# EAGLE design MorphingVCA (EAGLE 7.2.0)
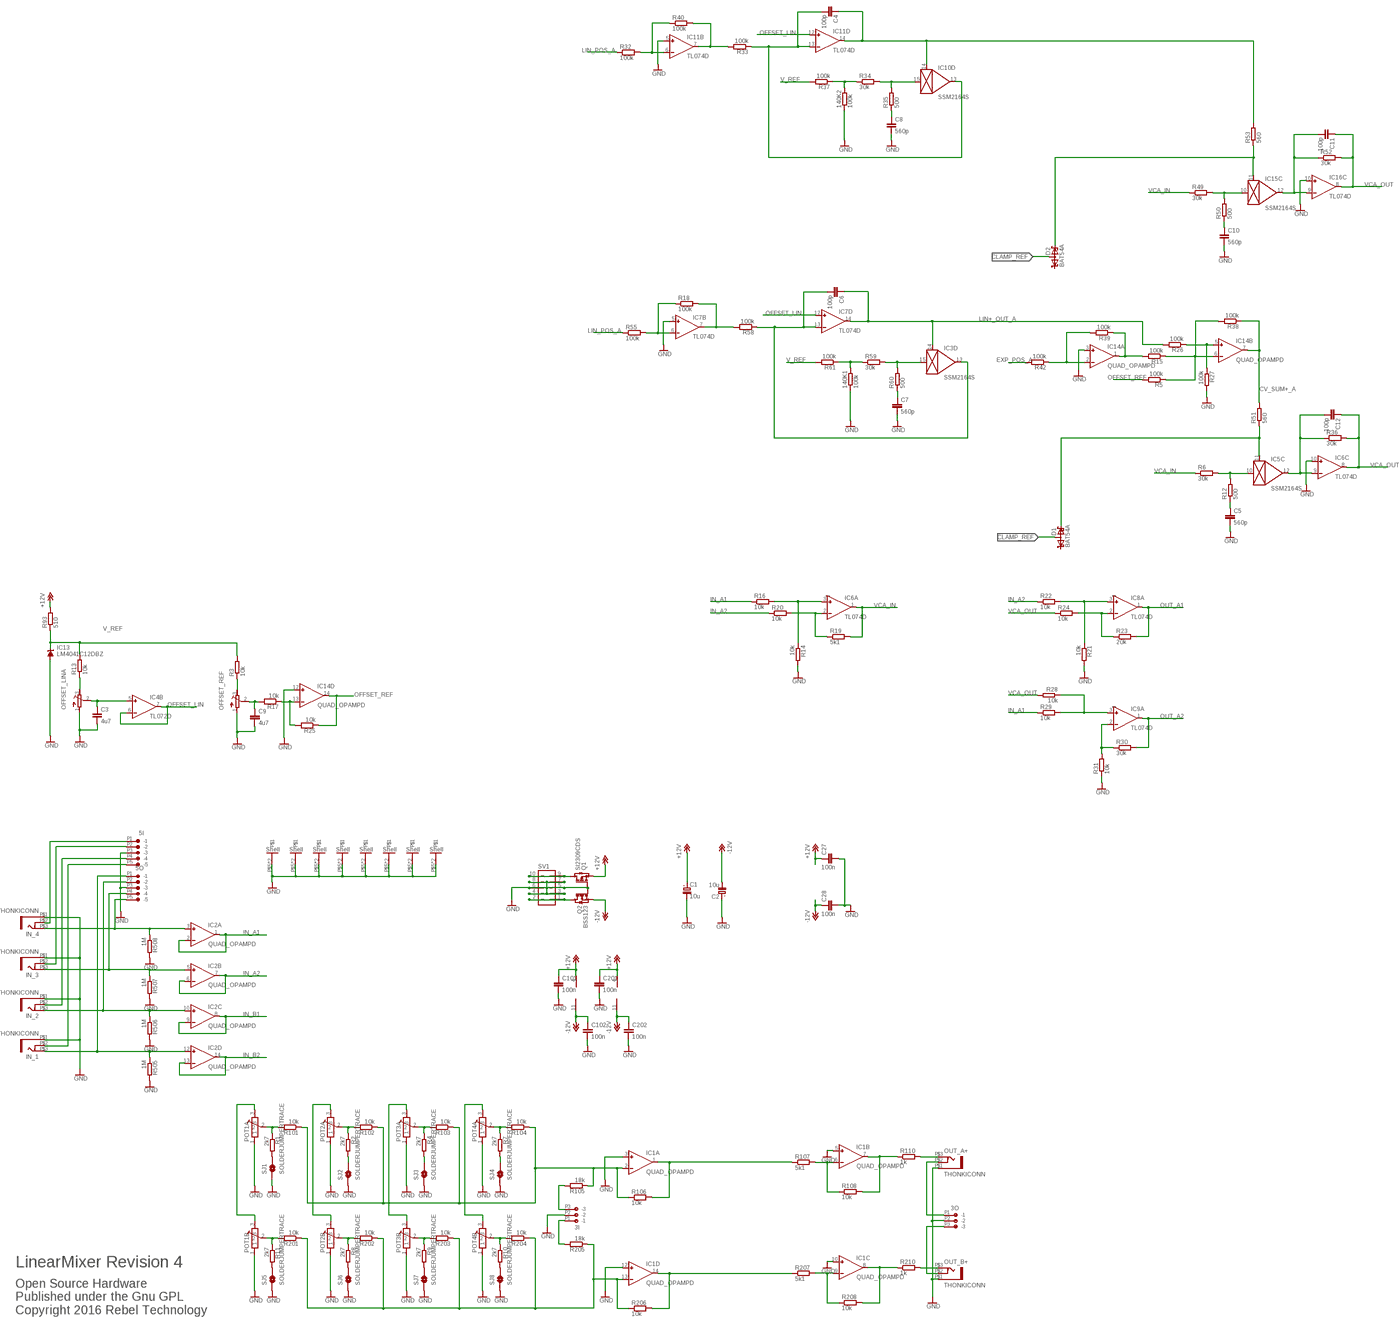
[diagram p0: schematic, sheet 1, overview]
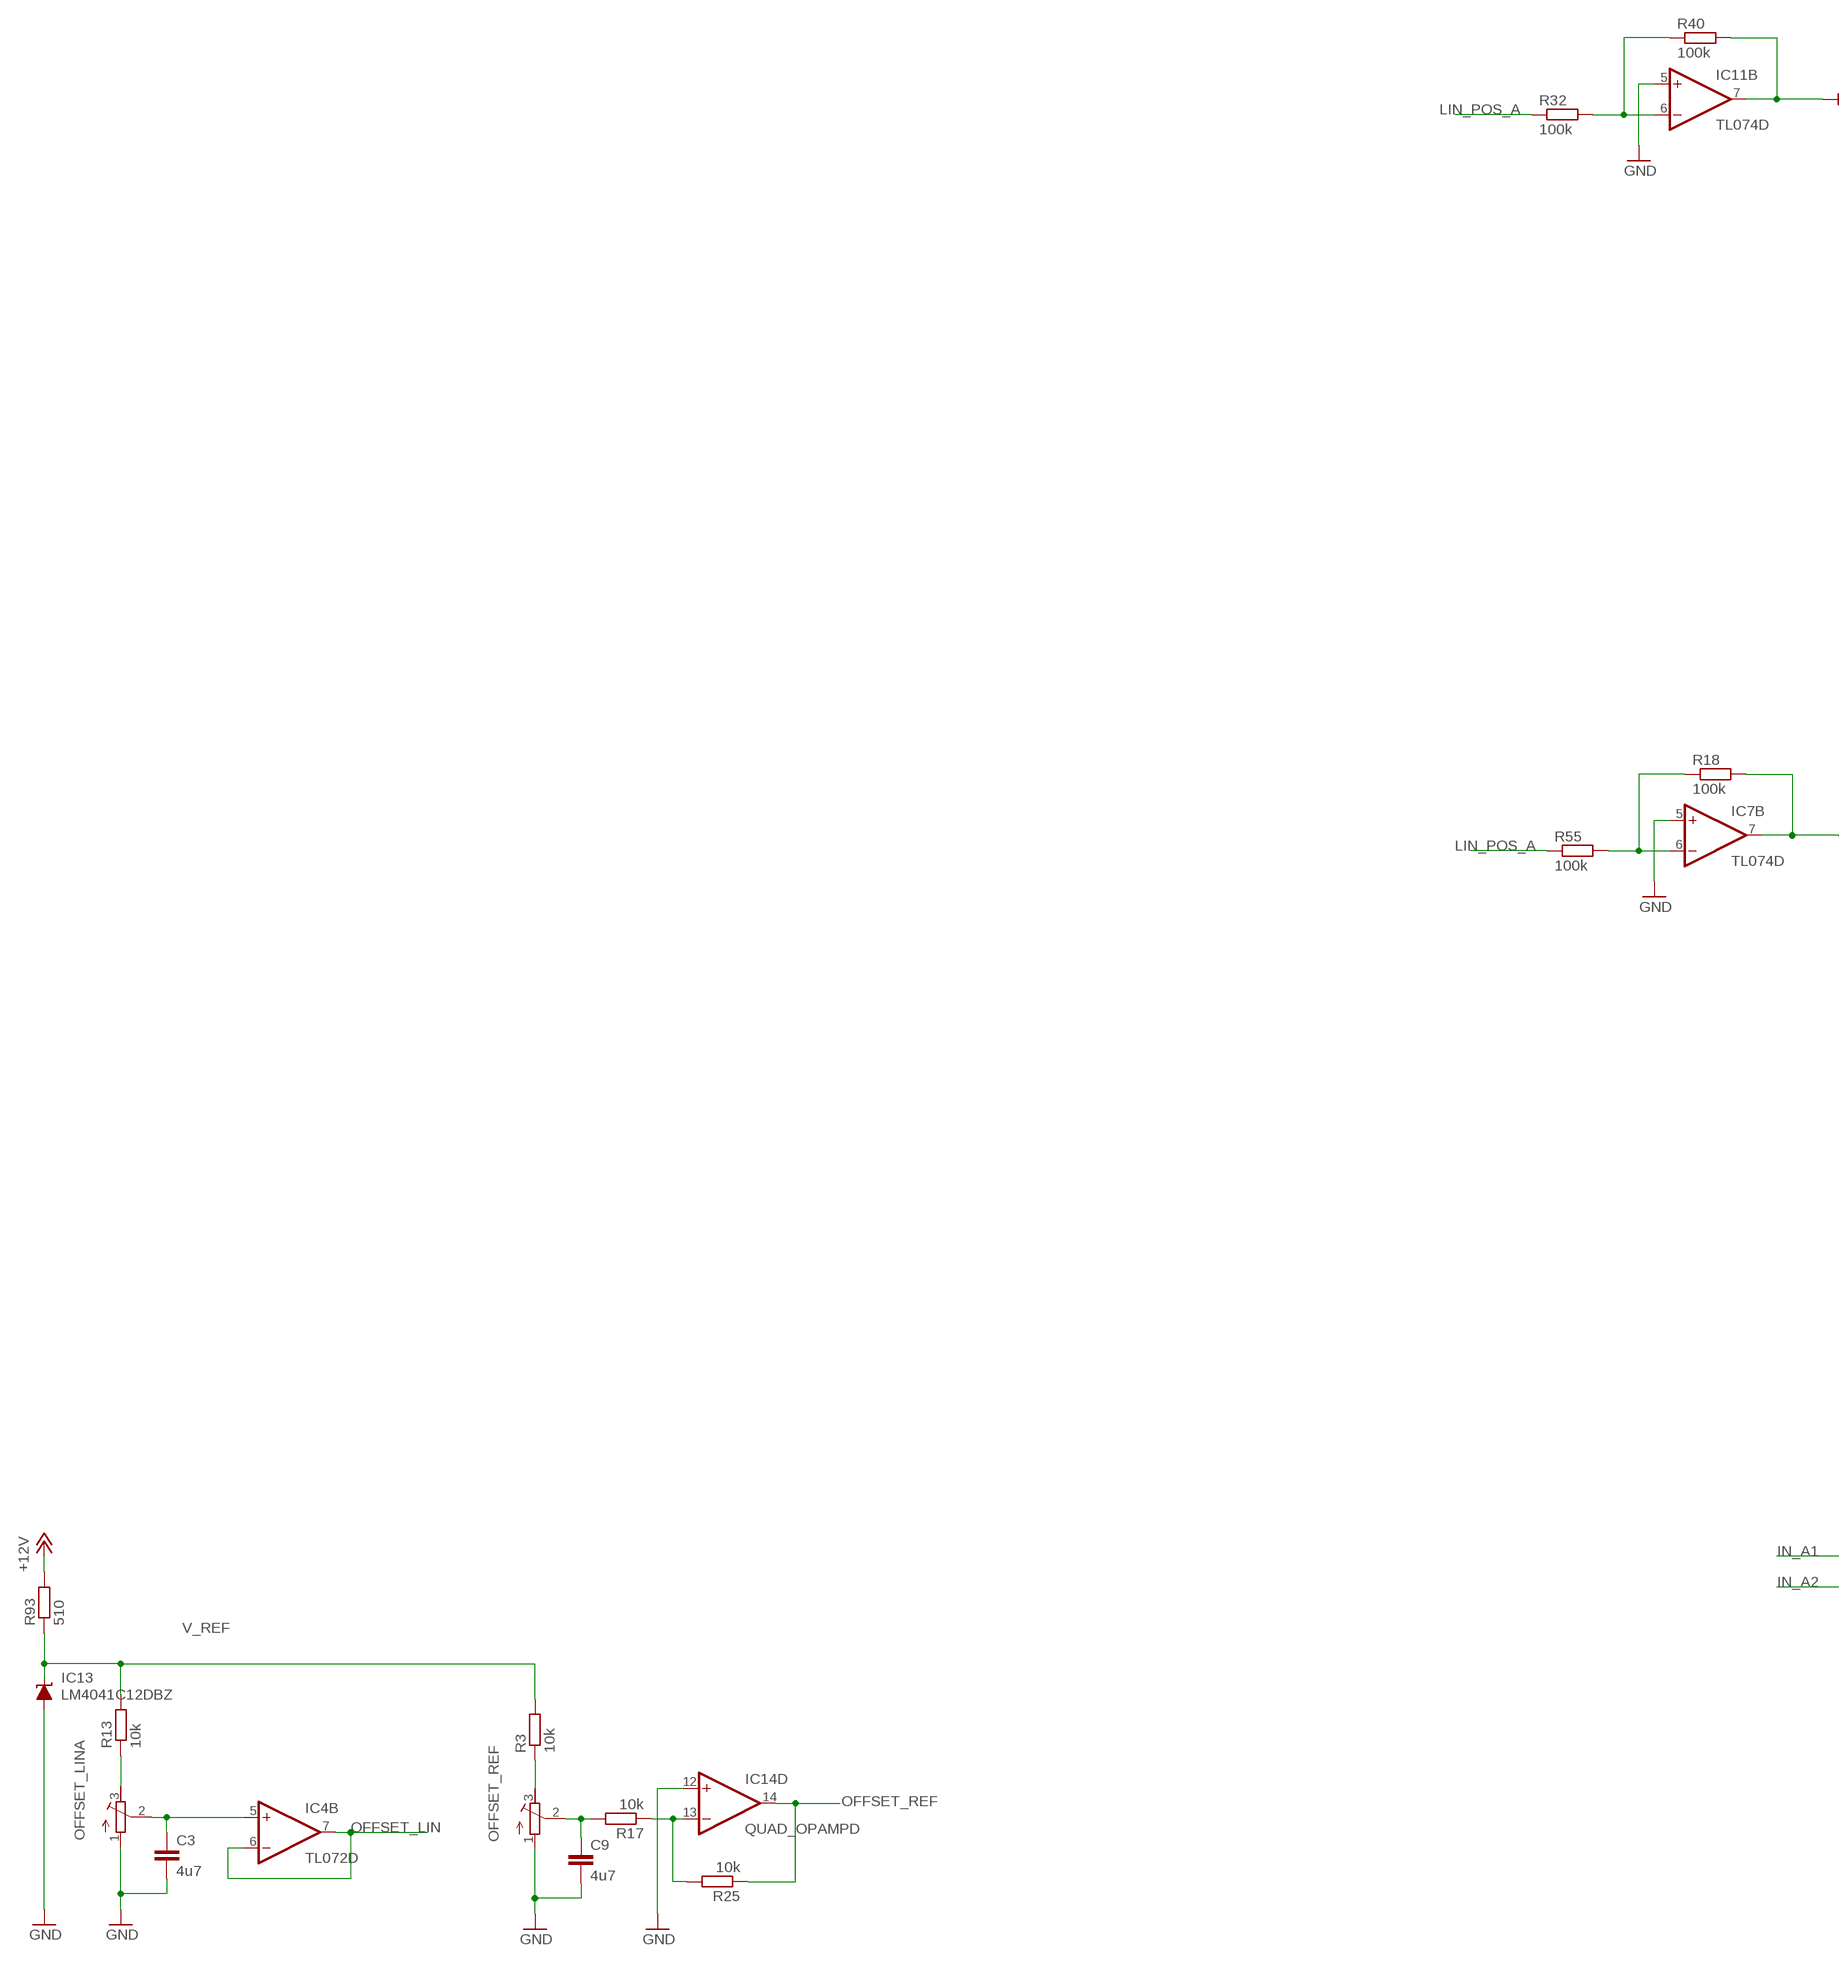
[diagram p1: schematic, sheet 1, part 1 of 4]
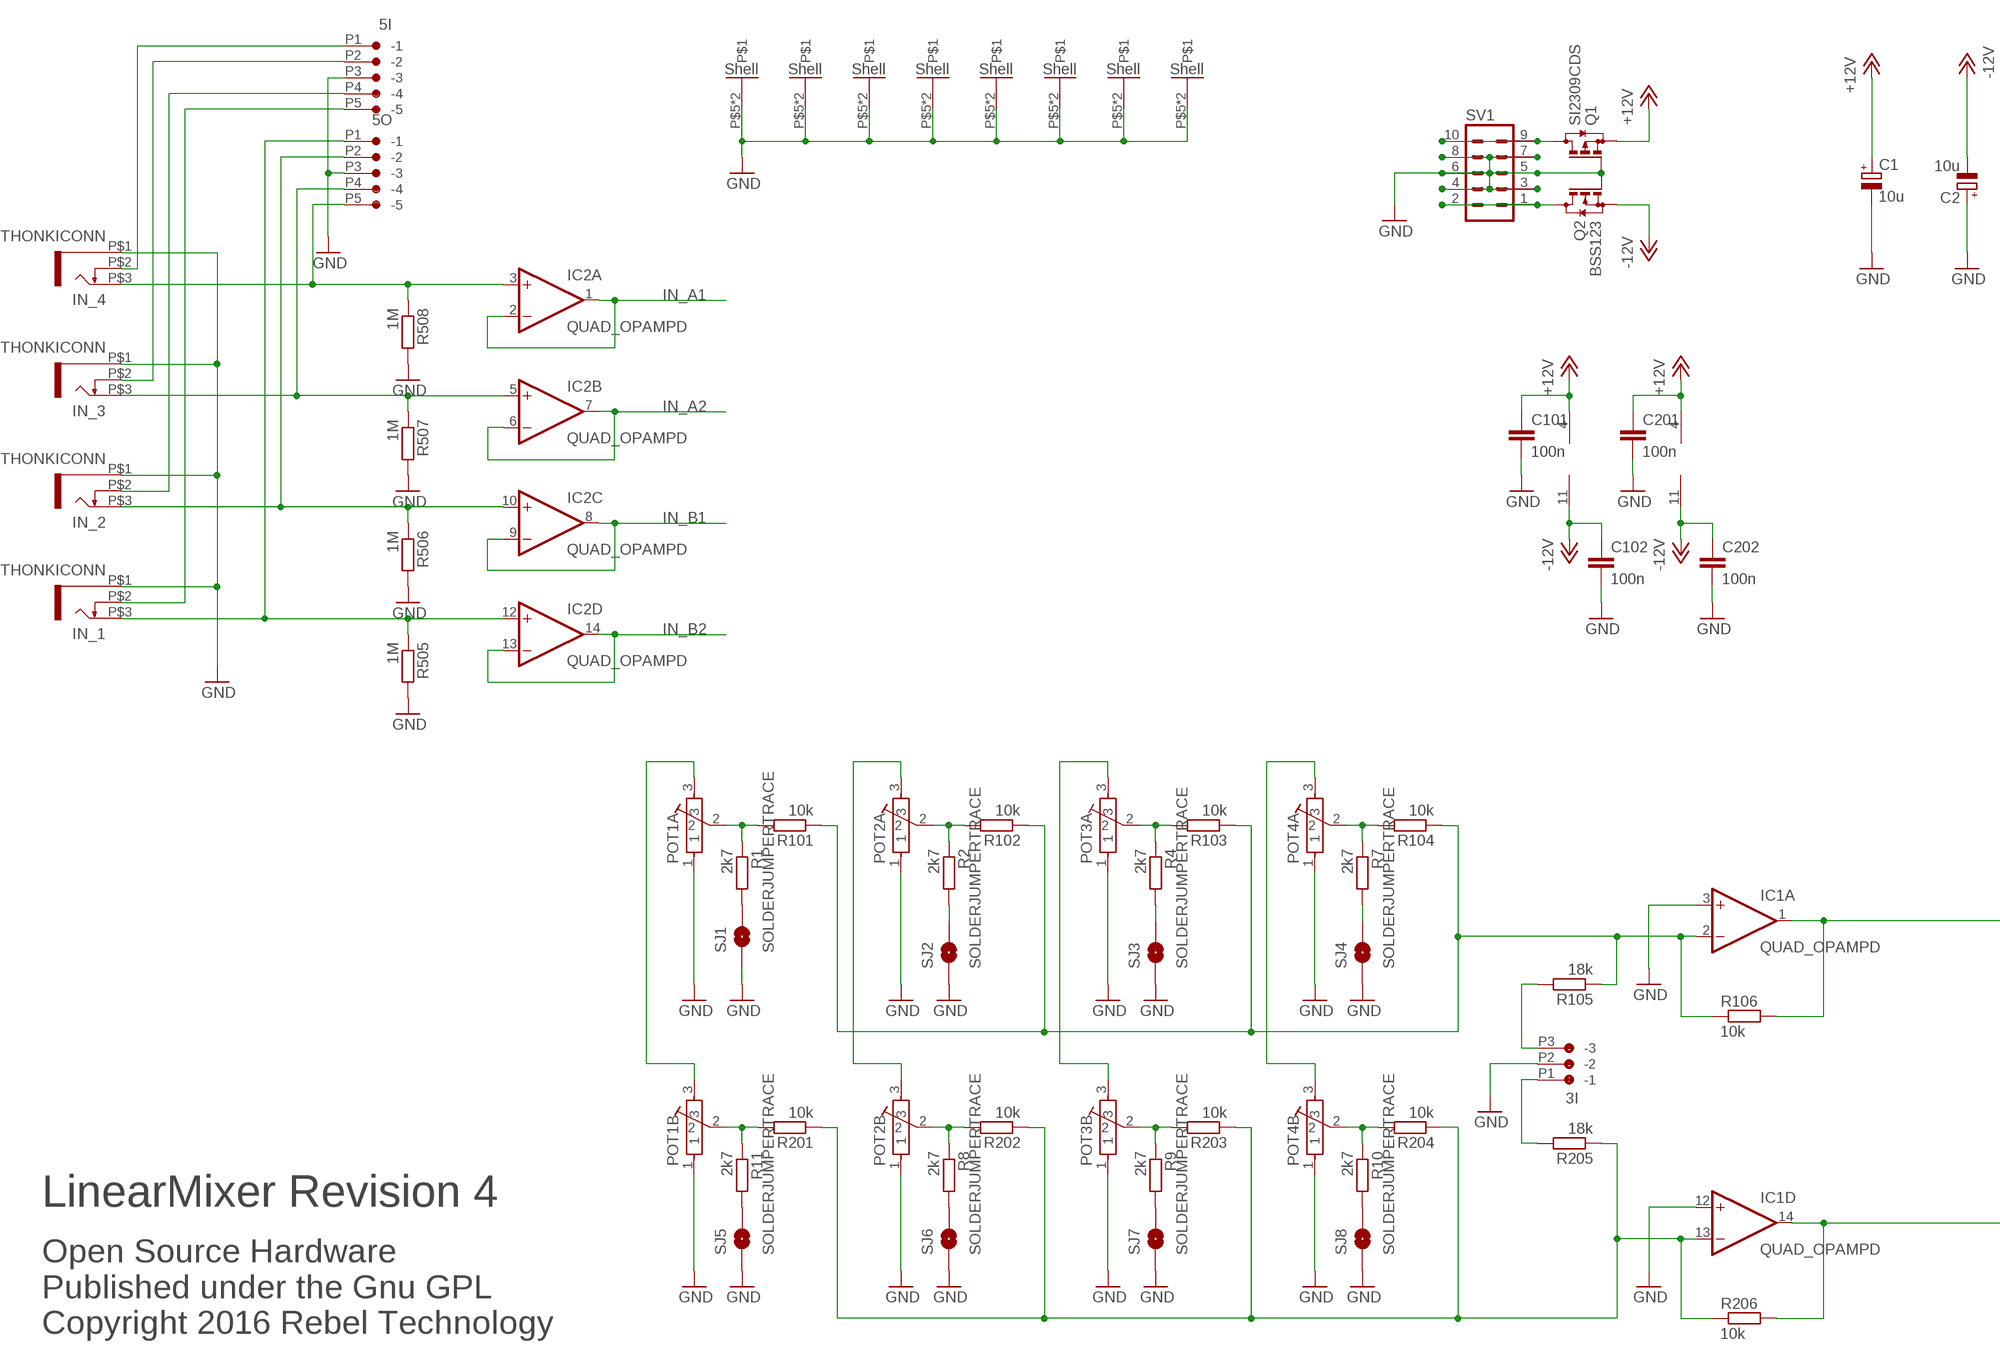
[diagram p2: schematic, sheet 1, part 2 of 4]
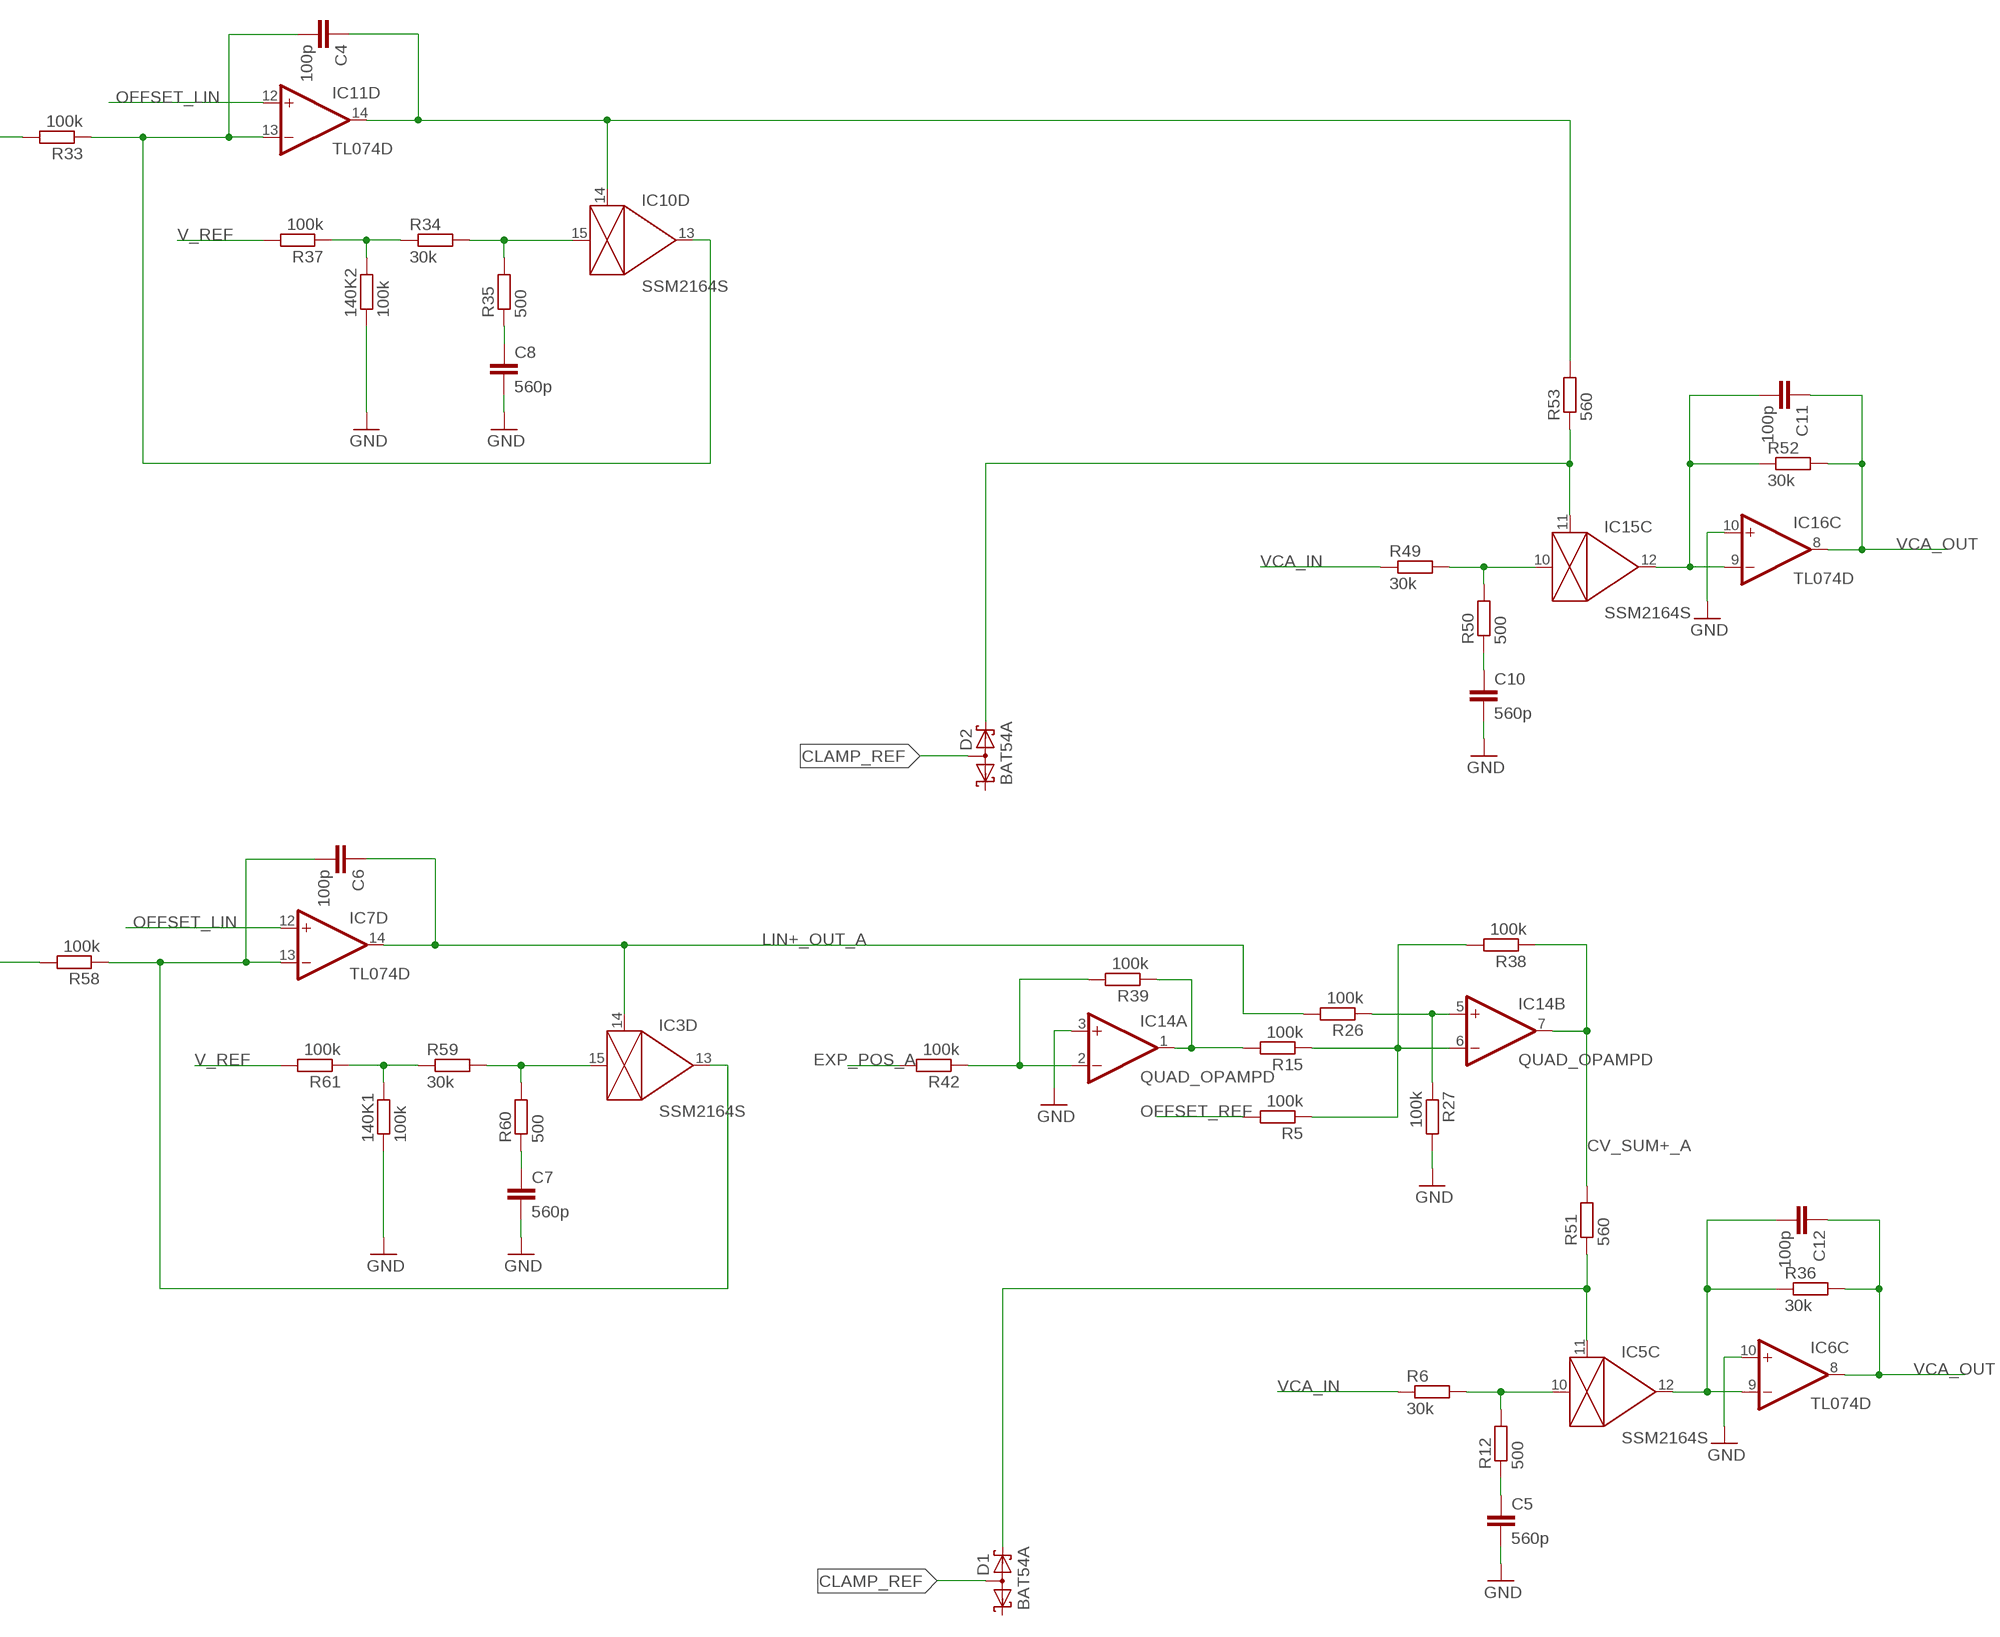
[diagram p3: schematic, sheet 1, part 3 of 4]
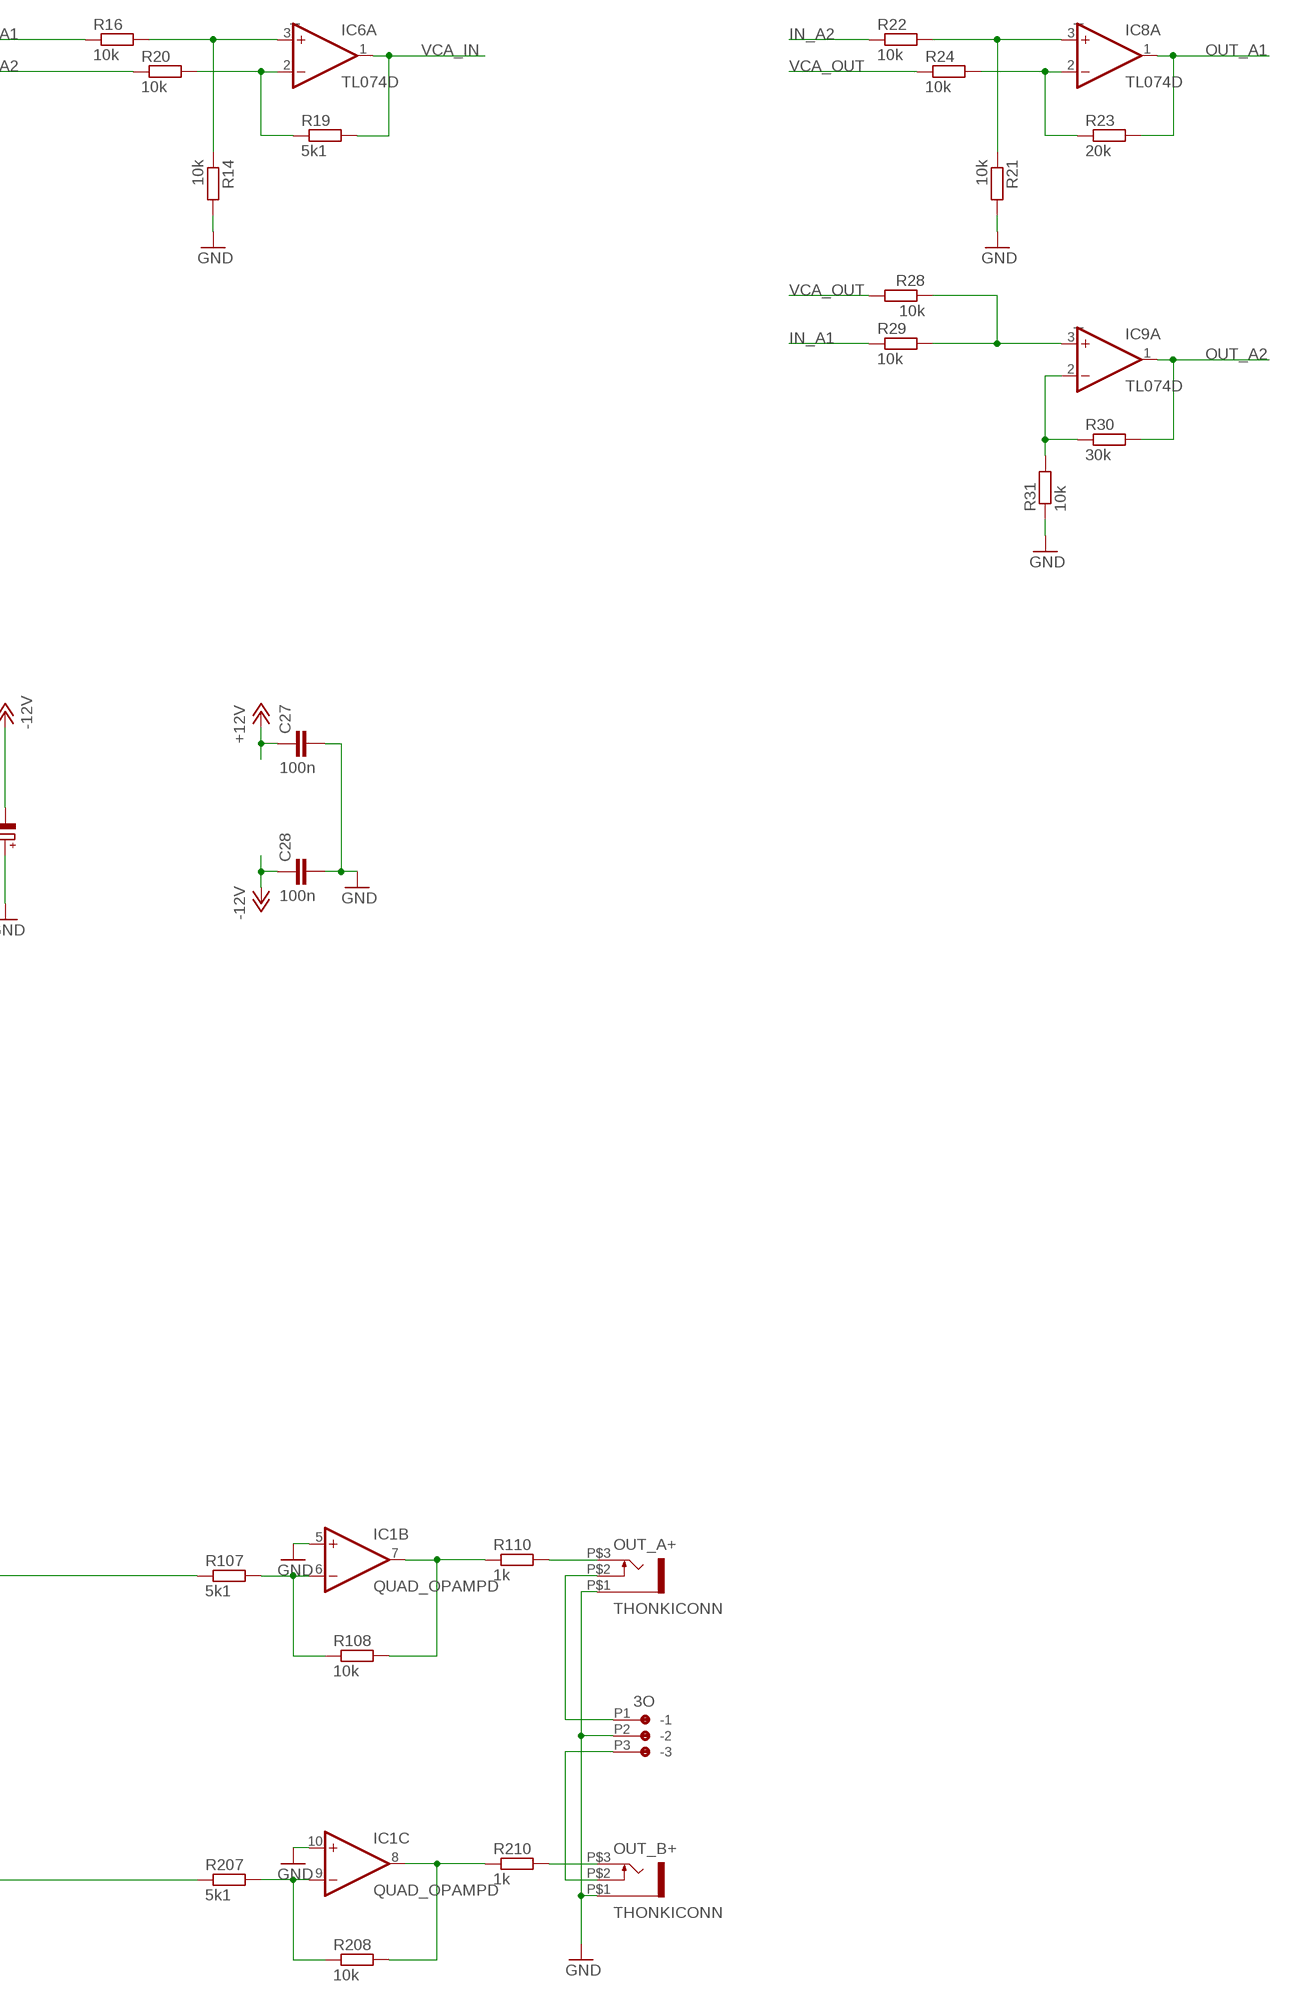
[diagram p4: schematic, sheet 1, part 4 of 4]

## Parts
3I  CON-JST_PH_3W  [CON-JST_PH_3W]
3O  CON-JST_PH_3W  [CON-JST_PH_3W]
5I  CON-JST_PH_5W  [CON-JST_PH_5W]
5O  CON-JST_PH_5W  [CON-JST_PH_5W]
140K1  100k  R-EU_0603  [0603]
140K2  100k  R-EU_0603  [0603]
C1  10u  CPOL-EU153CLV-0505  [153CLV-0505]
C2  10u  CPOL-EU153CLV-0505  [153CLV-0505]
C3  4u7  C-EUC0603K  [C0603K]
C4  100p  C-EUC0603K  [C0603K]
C5  560p  C-EUC0603K  [C0603K]
C6  100p  C-EUC0603K  [C0603K]
C7  560p  C-EUC0603K  [C0603K]
C8  560p  C-EUC0603K  [C0603K]
C9  4u7  C-EUC0603K  [C0603K]
C10  560p  C-EUC0603K  [C0603K]
C11  100p  C-EUC0603K  [C0603K]
C12  100p  C-EUC0603K  [C0603K]
C27  100n  C-EUC0603  [C0603]
C28  100n  C-EUC0603  [C0603]
C101  100n  C-EUC0603  [C0603]
C102  100n  C-EUC0603  [C0603]
C201  100n  C-EUC0603  [C0603]
C202  100n  C-EUC0603  [C0603]
D1  BAT54A  [SOT23]
D2  BAT54A  [SOT23]
IC1  QUAD_OPAMPD  [SO14]
IC2  QUAD_OPAMPD  [SO14]
IC3  SSM2164S  [SOIC16N]
IC4  TL072D  [SO08]
IC5  SSM2164S  [SOIC16N]
IC6  TL074D  [SO14]
IC7  TL074D  [SO14]
IC8  TL074D  [SO14]
IC9  TL074D  [SO14]
IC10  SSM2164S  [SOIC16N]
IC11  TL074D  [SO14]
IC13  LM4041C12DBZ  [DBZ_R-PDSO-G3]
IC14  QUAD_OPAMPD  [SO14]
IC15  SSM2164S  [SOIC16N]
IC16  TL074D  [SO14]
IN_1  THONKICONN  [THONKICONN]
IN_2  THONKICONN  [THONKICONN]
IN_3  THONKICONN  [THONKICONN]
IN_4  THONKICONN  [THONKICONN]
OFFSET_LINA  R-TRIMM64W  [RTRIM64W]
OFFSET_REF  R-TRIMM64W  [RTRIM64W]
OUT_A+  THONKICONN  [THONKICONN]
OUT_B+  THONKICONN  [THONKICONN]
POT1A  POT-ALPS-RK09L1140  [POT-ALPS-RK09L1140]
POT1B  POT-ALPS-RK09L1140  [POT-ALPS-RK09L1140]
POT2A  POT-ALPS-RK09L1140  [POT-ALPS-RK09L1140]
POT2B  POT-ALPS-RK09L1140  [POT-ALPS-RK09L1140]
POT3A  POT-ALPS-RK09L1140  [POT-ALPS-RK09L1140]
POT3B  POT-ALPS-RK09L1140  [POT-ALPS-RK09L1140]
POT4A  POT-ALPS-RK09L1140  [POT-ALPS-RK09L1140]
POT4B  POT-ALPS-RK09L1140  [POT-ALPS-RK09L1140]
Q1  SI2309CDS  BSS84  [SOT23]
Q2  BSS123  [SOT23]
R1  2k7  R-EU_R0603  [R0603]
R2  2k7  R-EU_R0603  [R0603]
R3  10k  R-EU_0603  [0603]
R4  2k7  R-EU_R0603  [R0603]
R5  100k  R-EU_0603  [0603]
R6  30k  R-EU_0603  [0603]
R7  2k7  R-EU_R0603  [R0603]
R8  2k7  R-EU_R0603  [R0603]
R9  2k7  R-EU_R0603  [R0603]
R10  2k7  R-EU_R0603  [R0603]
R11  2k7  R-EU_R0603  [R0603]
R12  500  R-EU_0603  [0603]
R13  10k  R-EU_0603  [0603]
R14  10k  R-EU_0603  [0603]
R15  100k  R-EU_0603  [0603]
R16  10k  R-EU_0603  [0603]
R17  10k  R-EU_0603  [0603]
R18  100k  R-EU_0603  [0603]
R19  5k1  R-EU_0603  [0603]
R20  10k  R-EU_0603  [0603]
R21  10k  R-EU_0603  [0603]
R22  10k  R-EU_0603  [0603]
R23  20k  R-EU_0603  [0603]
R24  10k  R-EU_0603  [0603]
R25  10k  R-EU_0603  [0603]
R26  100k  R-EU_0603  [0603]
R27  100k  R-EU_0603  [0603]
R28  10k  R-EU_0603  [0603]
R29  10k  R-EU_0603  [0603]
R30  30k  R-EU_0603  [0603]
R31  10k  R-EU_0603  [0603]
R32  100k  R-EU_0603  [0603]
R33  100k  R-EU_0603  [0603]
R34  30k  R-EU_0603  [0603]
R35  500  R-EU_0603  [0603]
R36  30k  R-EU_0603  [0603]
R37  100k  R-EU_0603  [0603]
R38  100k  R-EU_0603  [0603]
R39  100k  R-EU_0603  [0603]
R40  100k  R-EU_0603  [0603]
R42  100k  R-EU_0603  [0603]
R49  30k  R-EU_0603  [0603]
R50  500  R-EU_0603  [0603]
R51  560  R-EU_0603  [0603]
R52  30k  R-EU_0603  [0603]
R53  560  R-EU_0603  [0603]
R55  100k  R-EU_0603  [0603]
R58  100k  R-EU_0603  [0603]
R59  30k  R-EU_0603  [0603]
R60  500  R-EU_0603  [0603]
R61  100k  R-EU_0603  [0603]
R93  510  R-EU_0603  [0603]
R101  10k  R-EU_R0603  [R0603]
R102  10k  R-EU_R0603  [R0603]
R103  10k  R-EU_R0603  [R0603]
R104  10k  R-EU_R0603  [R0603]
R105  18k  R-EU_R0603  [R0603]
R106  10k  R-EU_R0603  [R0603]
R107  5k1  R-EU_R0603  [R0603]
R108  10k  R-EU_R0603  [R0603]
R110  1k  R-EU_R0603  [R0603]
R201  10k  R-EU_R0603  [R0603]
R202  10k  R-EU_R0603  [R0603]
R203  10k  R-EU_R0603  [R0603]
R204  10k  R-EU_R0603  [R0603]
R205  18k  R-EU_R0603  [R0603]
R206  10k  R-EU_R0603  [R0603]
R207  5k1  R-EU_R0603  [R0603]
R208  10k  R-EU_R0603  [R0603]
R210  1k  R-EU_R0603  [R0603]
R505  1M  R-EU_R0603  [R0603]
R506  1M  R-EU_R0603  [R0603]
R507  1M  R-EU_R0603  [R0603]
R508  1M  R-EU_R0603  [R0603]
SJ1  SOLDERJUMPERTRACE  [SJ_2S-TRACE]
SJ2  SOLDERJUMPERTRACE  [SJ_2S-TRACE]
SJ3  SOLDERJUMPERTRACE  [SJ_2S-TRACE]
SJ4  SOLDERJUMPERTRACE  [SJ_2S-TRACE]
SJ5  SOLDERJUMPERTRACE  [SJ_2S-TRACE]
SJ6  SOLDERJUMPERTRACE  [SJ_2S-TRACE]
SJ7  SOLDERJUMPERTRACE  [SJ_2S-TRACE]
SJ8  SOLDERJUMPERTRACE  [SJ_2S-TRACE]
SV1  MA05-2  [MA05-2]

## Nets
+12V: C1.+ C27.1 C101.1 C201.1 IC1.4(P:V+) IC2.4(P:V+) Q1.2(S) R93.2
-10V1: 140K1.2 R59.1 R61.1
-10V2: 140K2.2 R34.1 R37.1
-12V: C2.- C28.1 C102.1 C202.1 IC1.11(P:V-) IC2.11(P:V-) Q2.2(S)
CLAMP_REF: D1.3(AA) D2.3(AA)
CV_SUM+_A: IC14.7(B:OUT) R38.1 R51.2
EXP_POS_A: R42.2
GND: 3I.P2(-2) 3O.P2(-2) 5I.P3(-3) 5O.P3(-3) 140K1.1 140K2.1 C1.- C2.+ C3.2 C5.2 C7.2 C8.2 C9.2 C10.2 C27.2 C28.2 C101.2 C102.2 C201.2 C202.2 IC1.3(A:+IN) IC1.5(B:+IN) IC1.10(C:+IN) IC1.12(D:+IN) IC6.10(C:+IN) IC7.5(B:+IN) IC11.5(B:+IN) IC13.2(A) IC14.3(A:+IN) IC14.12(D:+IN) IC16.10(C:+IN) IN_1.P$1 IN_2.P$1 IN_3.P$1 IN_4.P$1 OFFSET_LINA.1(A) OFFSET_REF.1(A) OUT_A+.P$1 OUT_B+.P$1 POT1A.1 POT1A.P$5 POT1A.P$6 POT1B.1 POT1B.P$5 POT1B.P$6 POT2A.1 POT2A.P$5 POT2A.P$6 POT2B.1 POT2B.P$5 POT2B.P$6 POT3A.1 POT3A.P$5 POT3A.P$6 POT3B.1 POT3B.P$5 POT3B.P$6 POT4A.1 POT4A.P$5 POT4A.P$6 POT4B.1 POT4B.P$5 POT4B.P$6 Q1.1(G) Q2.1(G) R14.2 R21.2 R27.2 R31.1 R505.2 R506.2 R507.2 R508.2 SJ1.1 SJ2.1 SJ3.1 SJ4.1 SJ5.1 SJ6.1 SJ7.1 SJ8.1 SV1.3 SV1.4 SV1.5 SV1.6 SV1.7 SV1.8
IC2_1: C4.2 IC10.13(D:OUT) IC11.13(D:-IN) R33.1
IC2_8: IC14.6(B:-IN) R5.1 R15.1 R38.2
IC2_13: C6.2 IC3.13(D:OUT) IC7.13(D:-IN) R58.1
IC2C_1: D2.2(K2) IC15.11(C:CTRL) R53.1
IC2C_11: D1.2(K2) IC5.11(C:CTRL) R51.1
IN_1: 5O.P1(-1) IC2.12(D:+IN) IN_1.P$3 R505.1
IN_2: 5O.P2(-2) IC2.10(C:+IN) IN_2.P$3 R506.1
IN_3: 5O.P4(-4) IC2.5(B:+IN) IN_3.P$3 R507.1
IN_4: 5O.P5(-5) IC2.3(A:+IN) IN_4.P$3 R508.1
IN_A: 3I.P3(-3) R105.2
IN_A1: IC2.1(A:OUT) IC2.2(A:-IN) R16.1
IN_A2: IC2.6(B:-IN) IC2.7(B:OUT) R20.1 R22.1
IN_B: 3I.P1(-1) R205.2
IN_B1: IC2.8(C:OUT) IC2.9(C:-IN)
IN_B2: IC2.13(D:-IN) IC2.14(D:OUT)
IN_SW_1: 5I.P5(-5) IN_1.P$2
IN_SW_2: 5I.P4(-4) IN_2.P$2
IN_SW_3: 5I.P2(-2) IN_3.P$2
IN_SW_4: 5I.P1(-1) IN_4.P$2
LIN+_OUT_A: C4.1 C6.1 IC3.14(D:CTRL) IC7.14(D:OUT) IC10.14(D:CTRL) IC11.14(D:OUT) R26.2 R53.2
LIN_POS_A: R32.1 R55.1
N$1: Q2.3(D) SV1.1 SV1.2
N$2: IC7.7(B:OUT) R18.2 R58.2
N$3: IC7.6(B:-IN) R18.1 R55.2
N$4: OFFSET_LINA.3(E) R13.1
N$5: IC1.8(C:OUT) R208.2 R210.1
N$6: IC1.7(B:OUT) R108.2 R110.1
N$7: IC1.13(D:-IN) R201.1 R202.1 R203.1 R204.1 R205.1 R206.1
N$8: C3.1 IC4.5(B:+IN) OFFSET_LINA.2(S)
N$9: OUT_A+.P$3 R110.2
N$10: IC1.14(D:OUT) R206.2 R207.1
N$11: IC1.2(A:-IN) R101.1 R102.1 R103.1 R104.1 R105.1 R106.1
N$12: IC14.2(A:-IN) R39.2 R42.1
N$13: IC1.1(A:OUT) R106.2 R107.1
N$14: Q1.3(D) SV1.9 SV1.10
N$15: OUT_B+.P$3 R210.2
N$16: IC14.1(A:OUT) R15.2 R39.1
N$17: R1.2 SJ1.2
N$18: IC1.6(B:-IN) R107.2 R108.1
N$19: OFFSET_REF.3(E) R3.1
N$20: POT1B.2 R11.1 R201.2
N$21: IC14.13(D:-IN) R17.1 R25.2
N$22: R2.2 SJ2.2
N$23: IC1.9(C:-IN) R207.2 R208.1
N$24: R4.2 SJ3.2
N$25: R7.2 SJ4.2
N$26: R11.2 SJ5.2
N$27: IC8.2(A:-IN) R23.1 R24.2
N$28: R8.2 SJ6.2
N$29: POT1A.2 R1.1 R101.2
N$30: POT2B.2 R8.1 R202.2
N$31: POT3B.2 R9.1 R203.2
N$32: R9.2 SJ7.2
N$33: R10.2 SJ8.2
N$34: POT1A.3 POT1B.3
N$35: IC8.3(A:+IN) R21.1 R22.2
N$36: POT2A.3 POT2B.3
N$37: POT3A.3 POT3B.3
N$38: POT4A.3 POT4B.3
N$39: IC14.5(B:+IN) R26.1 R27.1
N$40: C9.1 OFFSET_REF.2(S) R17.2
N$41: C5.1 R12.1
N$42: IC5.10(C:IN) R6.2 R12.2
N$43: C12.2 IC5.12(C:OUT) IC6.9(C:-IN) R36.1
N$44: POT4B.2 R10.1 R204.2
N$45: IC9.2(A:-IN) R30.1 R31.2
N$46: IC6.2(A:-IN) R19.1 R20.2
N$47: POT4A.2 R7.1 R104.2
N$48: IC6.3(A:+IN) R14.1 R16.2
N$49: POT3A.2 R4.1 R103.2
N$50: IC11.7(B:OUT) R33.2 R40.2
N$51: POT2A.2 R2.1 R102.2
N$52: R29.1
N$53: IC9.3(A:+IN) R28.1 R29.2
N$54: C7.1 R60.1
N$55: IC3.15(D:IN) R59.2 R60.2
N$56: C8.1 R35.1
N$57: IC10.15(D:IN) R34.2 R35.2
N$58: IC11.6(B:-IN) R32.2 R40.1
N$62: C10.1 R50.1
N$63: IC15.10(C:IN) R49.2 R50.2
N$64: C11.2 IC15.12(C:OUT) IC16.9(C:-IN) R52.1
OFFSET_LIN: IC4.6(B:-IN) IC4.7(B:OUT) IC7.12(D:+IN) IC11.12(D:+IN)
OFFSET_REF: IC14.14(D:OUT) R5.2 R25.1
OUT_A1: IC8.1(A:OUT) R23.2
OUT_A2: IC9.1(A:OUT) R30.2
OUT_SW_A: 3O.P1(-1) OUT_A+.P$2
OUT_SW_B: 3O.P3(-3) OUT_B+.P$2
V_REF: IC13.1(C) R3.2 R13.2 R37.2 R61.2 R93.1
VCA_IN: IC6.1(A:OUT) R6.1 R19.2 R49.1
VCA_OUT: C11.1 C12.1 IC6.8(C:OUT) IC16.8(C:OUT) R24.1 R28.2 R36.2 R52.2
Unconnected: D1.1(K1) D2.1(K1) IC3.1(E:MODE) IC3.2(A:IN) IC3.3(A:CTRL) IC3.4(A:OUT) IC3.5(B:OUT) IC3.6(B:CTRL) IC3.7(B:IN) IC3.10(C:IN) IC3.11(C:CTRL) IC3.12(C:OUT) IC4.1(A:OUT) IC4.2(A:-IN) IC4.3(A:+IN) IC5.1(E:MODE) IC5.2(A:IN) IC5.3(A:CTRL) IC5.4(A:OUT) IC5.5(B:OUT) IC5.6(B:CTRL) IC5.7(B:IN) IC5.13(D:OUT) IC5.14(D:CTRL) IC5.15(D:IN) IC6.5(B:+IN) IC6.6(B:-IN) IC6.7(B:OUT) IC6.12(D:+IN) IC6.13(D:-IN) IC6.14(D:OUT) IC7.1(A:OUT) IC7.2(A:-IN) IC7.3(A:+IN) IC7.8(C:OUT) IC7.9(C:-IN) IC7.10(C:+IN) IC8.5(B:+IN) IC8.6(B:-IN) IC8.7(B:OUT) IC8.8(C:OUT) IC8.9(C:-IN) IC8.10(C:+IN) IC8.12(D:+IN) IC8.13(D:-IN) IC8.14(D:OUT) IC9.5(B:+IN) IC9.6(B:-IN) IC9.7(B:OUT) IC9.8(C:OUT) IC9.9(C:-IN) IC9.10(C:+IN) IC9.12(D:+IN) IC9.13(D:-IN) IC9.14(D:OUT) IC10.1(E:MODE) IC10.2(A:IN) IC10.3(A:CTRL) IC10.4(A:OUT) IC10.5(B:OUT) IC10.6(B:CTRL) IC10.7(B:IN) IC10.10(C:IN) IC10.11(C:CTRL) IC10.12(C:OUT) IC11.1(A:OUT) IC11.2(A:-IN) IC11.3(A:+IN) IC11.8(C:OUT) IC11.9(C:-IN) IC11.10(C:+IN) IC14.8(C:OUT) IC14.9(C:-IN) IC14.10(C:+IN) IC15.1(E:MODE) IC15.2(A:IN) IC15.3(A:CTRL) IC15.4(A:OUT) IC15.5(B:OUT) IC15.6(B:CTRL) IC15.7(B:IN) IC15.13(D:OUT) IC15.14(D:CTRL) IC15.15(D:IN) IC16.1(A:OUT) IC16.2(A:-IN) IC16.3(A:+IN) IC16.5(B:+IN) IC16.6(B:-IN) IC16.7(B:OUT) IC16.12(D:+IN) IC16.13(D:-IN) IC16.14(D:OUT)

## Notes on the sheet
- LinearMixer Revision 4
- Open Source Hardware
  Published under the Gnu GPL
  Copyright 2016 Rebel Technology

## Power pins joined to a net without a drawn wire
GND: IC3.8(E:GND) IC5.8(E:GND) IC10.8(E:GND) IC15.8(E:GND)
V+: IC3.16(E:V+) IC4.8(P:V+) IC5.16(E:V+) IC6.4(P:V+) IC7.4(P:V+) IC8.4(P:V+) IC9.4(P:V+) IC10.16(E:V+) IC11.4(P:V+) IC14.4(P:V+) IC15.16(E:V+) IC16.4(P:V+)
V-: IC3.9(E:V-) IC4.4(P:V-) IC5.9(E:V-) IC6.11(P:V-) IC7.11(P:V-) IC8.11(P:V-) IC9.11(P:V-) IC10.9(E:V-) IC11.11(P:V-) IC14.11(P:V-) IC15.9(E:V-) IC16.11(P:V-)

## Library data of the parts
3I 3O = Rebel:CON-JST_PH_3W
5I 5O = Rebel:CON-JST_PH_5W
140K1 140K2 R3 R6 R12-R14 R16-R25 R28-R37 R40 R49-R53 R55 R58-R61 R93 = Rebel:R-EU_: RESISTOR, European symbol; OC_FARNELL: unknown
C1 C2 = rcl:CPOL-EU: POLARIZED CAPACITOR, European symbol
C3-C12 = resistor:C-EU: CAPACITOR, European symbol; OC_FARNELL: unknown
C27 C28 = Rebel:C-EU: CAPACITOR, European symbol
C101 C102 C201 C202 = resistor:C-EU: CAPACITOR, European symbol
D1 D2 = diode:BAT54A: Schottky Diodes Source: Fairchild .. BAT54.pdf
IC1 IC2 IC14 = adafruit:QUAD_OPAMP: OP AMP Standard quad package
IC3 IC5 IC10 IC15 = ssm2164:SSM2164; OC_FARNELL: unknown
IC4 = linear:TL072: OP AMP
IC6-IC9 IC11 IC16 = linear:TL074: OP AMP; OC_FARNELL: unknown
IC13 = texas:LM4041: PRECISION MICROPOWER SHUNT VOLTAGE REFERENCE Source: http://focus.ti.com/lit/ds/slcs146e/slcs146e.pdf; MF: TEXAS INSTRUMENT CONNECTORS; MPN: LM4041C12QDBZT; OC_FARNELL: 1771733; OC_NEWARK: 43K3376
IN_1-IN_4 OUT_A+ OUT_B+ = Rebel:THONKICONN
OFFSET_LINA OFFSET_REF = resistor:R-TRIMM: Trimm resistor; OC_FARNELL: unknown
POT1A POT1B POT2A POT2B POT3A POT3B POT4A POT4B = Rebel:POT-ALPS-RK09L
Q1 = transistor-small-signal:BSS84: P-CHANNEL MOS FET
Q2 = transistor-small-signal:BSS123: N-CHANNEL MOS FET
R1 R2 R4 R7-R11 R101-R108 R110 R201-R208 R210 R505-R508 = resistor:R-EU_: RESISTOR, European symbol
R5 R15 R26 R27 R38 R39 R42 = Rebel:R-EU_: RESISTOR, European symbol
SJ1-SJ8 = SparkFun:SOLDERJUMPER: Solder Jumper Standard SMD solder jumper. Used to automate production. Two varients : Normally Open and Normally Closed are the same, but have different paste layers. NC will have a large amount of paste and should jumper during reflow.
SV1 = con-lstb:MA05-2: PIN HEADER; OC_FARNELL: unknown; OC_NEWARK: unknown

## Board
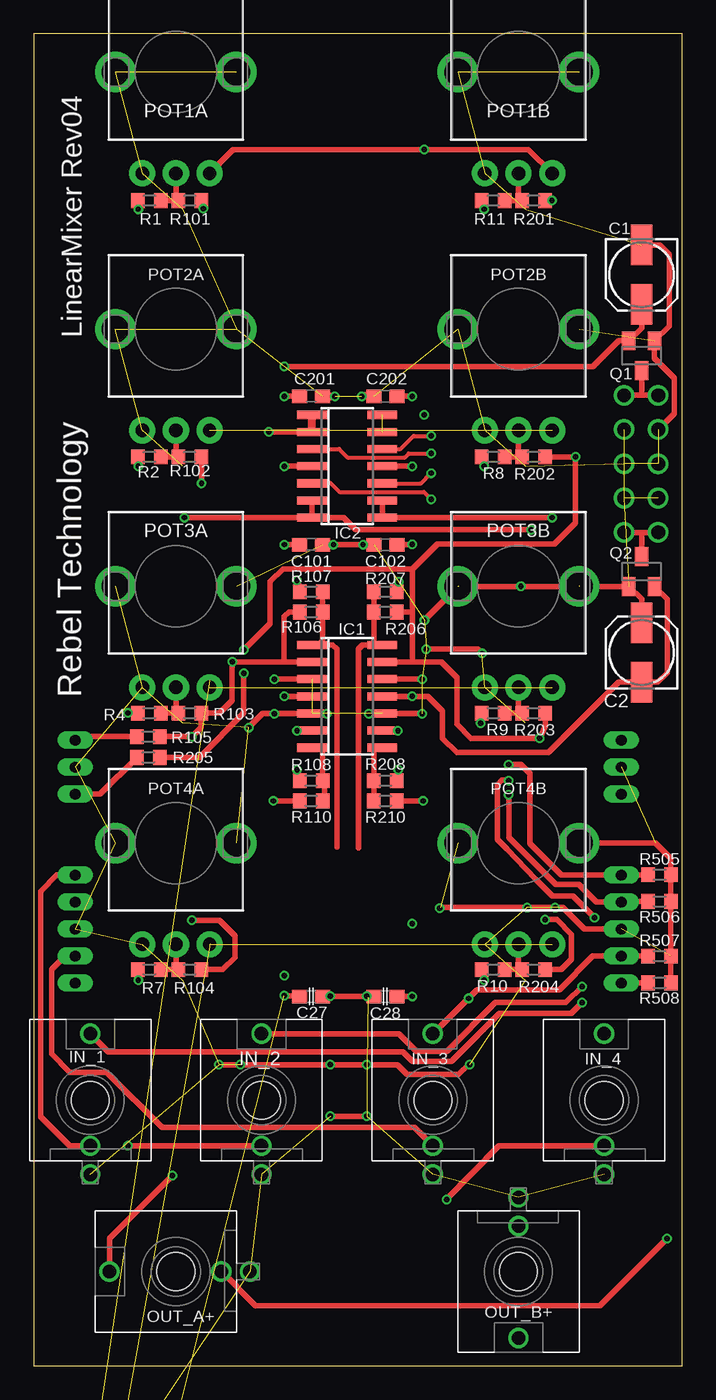
[diagram p5: board, top side]
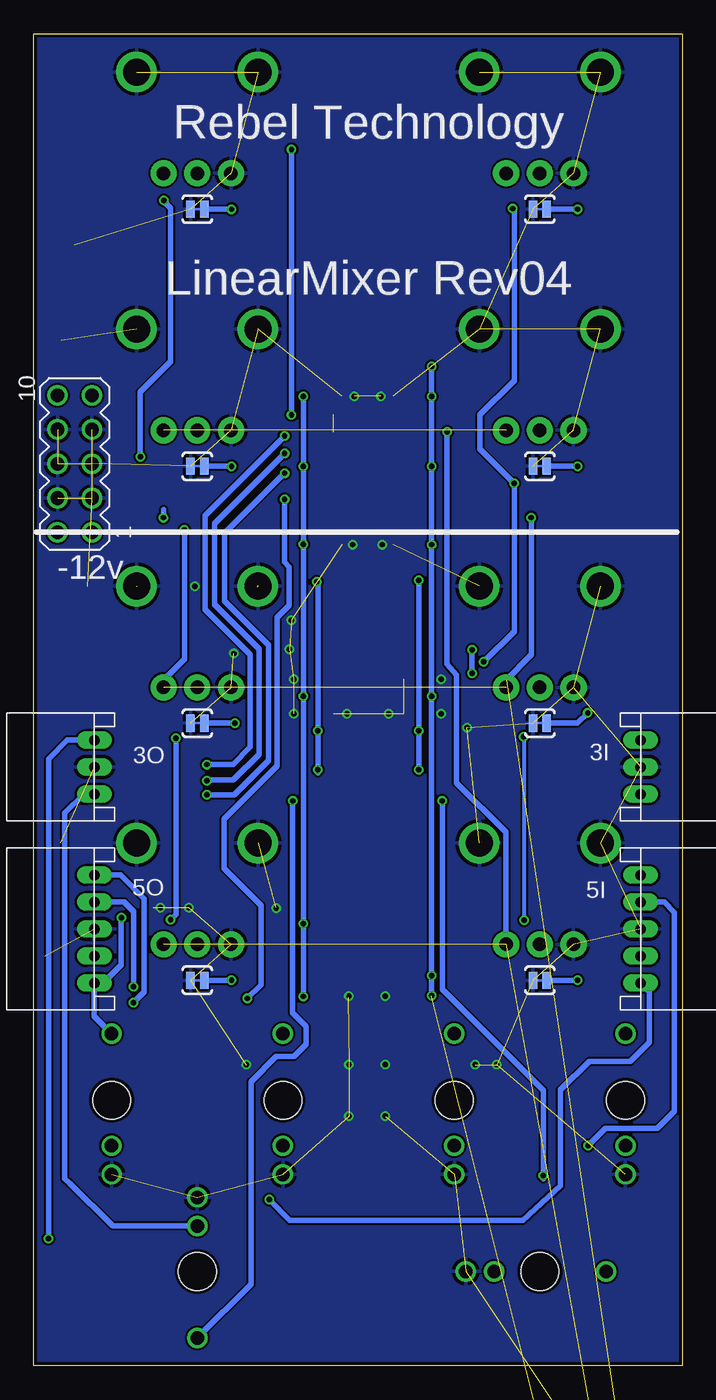
[diagram p6: board, bottom side, seen from below]

Size 48.07 x 98.73 mm. Coordinates in mm from the lower left corner, seen from the top.
Outline: 48.07,0 48.07,98.73 0,98.73 0,0 48.07,0
Copper layers (1*16): Top 0.035mm / dielectric 1.5mm / Bottom 0.035mm
Design rules "SeeedStudio_2layer_DRU_no_angle_20140221": minimum track width 6mil, minimum drill 12mil, track to track 6mil, track to pad 6mil, pad to pad 6mil, via to via 6mil, smd to smd 0mil, copper to edge 10mil, drill to drill 10mil, minimum pad ring 10mil, minimum via ring 6mil, stop-mask expansion 2mil, vias tented up to drill 100mil, thermal gap 10mil

### Footprints (pad centres in the part's own frame; a part is rotated, then mirrored left to right if it is on the bottom)
CON-JST_PH_3W = drill 0.8 long: P1 0,0; P2 -2,0; P3 -4,0
CON-JST_PH_5W = drill 0.8 long: P1 0,0; P2 -2,0; P3 -4,0; P4 -6,0; P5 -8,0
0603 = smd 1.1 x 1: 1 -0.85,0; 2 0.85,0
153CLV-0505 = smd 3 x 1.6: + 2.2,0; - -2.2,0
C0603K = smd 1.05 x 1.08: 1 -0.875,0; 2 0.875,0
C0603 = smd 1.1 x 1: 1 -0.85,0; 2 0.85,0
SOT23 = smd 1 x 1.4: 1 -0.95,-1.1; 2 0.95,-1.1; 3 0,1.1
SO14 = smd 0.6 x 2.2: 1 -3.81,-2.6; 2 -2.54,-2.6; 3 -1.27,-2.6; 4 0,-2.6; 5 1.27,-2.6; 6 2.54,-2.6; 7 3.81,-2.6; 8 3.81,2.6; 9 2.54,2.6; 10 1.27,2.6; 11 0,2.6; 12 -1.27,2.6; 13 -2.54,2.6; 14 -3.81,2.6
SOIC16N = smd 0.6 x 2.2: 1 -4.445,-2.6; 2 -3.175,-2.6; 3 -1.905,-2.6; 4 -0.635,-2.6; 5 0.635,-2.6; 6 1.905,-2.6; 7 3.175,-2.6; 8 4.445,-2.6; 9 4.445,2.6; 10 3.175,2.6; 11 1.905,2.6; 12 0.635,2.6; 13 -0.635,2.6; 14 -1.905,2.6; 15 -3.175,2.6; 16 -4.445,2.6
SO08 = smd 0.6 x 2.2: 1 -1.905,-2.6; 2 -0.635,-2.6; 3 0.635,-2.6; 4 1.905,-2.6; 5 1.905,2.6; 6 0.635,2.6; 7 -0.635,2.6; 8 -1.905,2.6
DBZ_R-PDSO-G3 = smd 0.7 x 1: 1 -0.95,-1.1; 2 0.95,-1.1; 3 0,1.1
THONKICONN = drill 1: P$1 0,-5.5; P$2 0,-3.38; P$3 0,4.92 | hole 2.8: 0,0
RTRIM64W = drill 0.61: 1 1.27,-2.54; 2 1.27,0; 3 1.27,2.54
POT-ALPS-RK09L1140 = drill 1 pad 1.93: 1 -2.5,-7.5; 2 0,-7.5; 3 2.5,-7.5 | drill 2: P$5 -4.5,0; P$6 4.5,0
R0603 = smd 1 x 1.1: 1 -0.85,0; 2 0.85,0
SJ_2S-TRACE = smd 0.635 x 1.27: 1 -0.508,0; 2 0.508,0
MA05-2 = drill 1.016: 1 -5.08,-1.27; 2 -5.08,1.27; 3 -2.54,-1.27; 4 -2.54,1.27; 5 0,-1.27; 6 0,1.27; 7 2.54,-1.27; 8 2.54,1.27; 9 5.08,-1.27; 10 5.08,1.27

### Placement (x,y rotation side)
3I  3.07,42.37 270 bottom
3O  43.57,46.37 90 bottom
5I  3.07,28.36 270 bottom
5O  43.57,36.37 90 bottom
140K1  -5.71,-37.72 0 top  (outside the outline)
140K2  0.13,-172.85 0 top  (outside the outline)
C1  45.07,80.86 270 top
C2  45.07,52.87 90 top
C3  -10.79,-37.72 0 top  (outside the outline)
C4  9.53,-164.97 0 top  (outside the outline)
C5  -2.92,-88.01 0 top  (outside the outline)
C6  4.19,-30.35 0 top  (outside the outline)
C7  9.02,-30.35 0 top  (outside the outline)
C8  14.35,-164.97 0 top  (outside the outline)
C9  -10.79,-60.32 0 top  (outside the outline)
C10  -10.79,-172.59 0 top  (outside the outline)
C11  -5.97,-172.59 0 top  (outside the outline)
C12  1.9,-88.01 0 top  (outside the outline)
C27  20.57,27.36 0 top
C28  26.07,27.36 180 top
C101  20.57,60.87 0 top
C102  26.07,60.87 180 top
C201  20.57,71.86 0 top
C202  26.07,71.86 180 top
D1  -10.03,-89.54 0 top  (outside the outline)
D2  2.41,-166.5 0 top  (outside the outline)
IC1  23.24,49.62 270 top
IC2  23.24,66.67 270 top
IC3  3.43,-22.73 0 top  (outside the outline)
IC4  -8,-24.51 0 top  (outside the outline)
IC5  -5.46,-82.17 0 top  (outside the outline)
IC6  -5.97,-74.55 0 top  (outside the outline)
IC7  1.14,-10.79 0 top  (outside the outline)
IC8  -5.97,-111.89 0 top  (outside the outline)
IC9  -5.97,-127.89 0 top  (outside the outline)
IC10  7.49,-157.35 0 top  (outside the outline)
IC11  6.73,-143.89 0 top  (outside the outline)
IC13  -10.03,-31.88 0 top  (outside the outline)
IC14  -5.97,-54.48 0 top  (outside the outline)
IC15  -5.46,-166.75 0 top  (outside the outline)
IC16  -5.97,-159.13 0 top  (outside the outline)
IN_1  4.19,19.68 0 top
IN_2  16.89,19.68 0 top
IN_3  29.59,19.68 0 top
IN_4  42.29,19.68 0 top
OFFSET_LINA  -8,-13.33 0 top  (outside the outline)
OFFSET_REF  4.7,-50.42 0 top  (outside the outline)
OUT_A+  10.54,6.99 90 top
OUT_B+  35.94,6.99 180 top
POT1A  10.54,95.88 0 top
POT1B  35.94,95.88 0 top
POT2A  10.54,76.83 0 top
POT2B  35.94,76.83 0 top
POT3A  10.54,57.79 0 top
POT3B  35.94,57.79 0 top
POT4A  10.54,38.73 0 top
POT4B  35.94,38.73 0 top
Q1  45.07,74.86 180 top
Q2  45.07,58.87 0 top
R1  8.57,86.36 180 top
R2  8.57,67.36 180 top
R3  -10.79,-67.95 0 top  (outside the outline)
R4  8.57,48.37 180 top
R5  -7.75,-67.95 0 top  (outside the outline)
R6  3.43,-95.38 0 top  (outside the outline)
R7  8.57,29.36 180 top
R8  34.07,67.36 180 top
R9  34.07,48.37 180 top
R10  34.07,29.36 180 top
R11  34.07,86.36 180 top
R12  -10.54,-95.38 0 top  (outside the outline)
R13  -1.14,-37.72 0 top  (outside the outline)
R14  -6.98,-95.38 0 top  (outside the outline)
R15  -6.48,-60.58 0 top  (outside the outline)
R16  -9.53,-98.68 0 top  (outside the outline)
R17  -2.92,-60.58 0 top  (outside the outline)
R18  2.41,-37.72 0 top  (outside the outline)
R19  -9.53,-101.98 0 top  (outside the outline)
R20  -9.53,-105.28 0 top  (outside the outline)
R21  -10.54,-117.98 0 top  (outside the outline)
R22  -6.98,-117.98 0 top  (outside the outline)
R23  -3.43,-117.98 0 top  (outside the outline)
R24  -10.54,-121.29 0 top  (outside the outline)
R25  4.19,-60.58 0 top  (outside the outline)
R26  -10.54,-64.64 0 top  (outside the outline)
R27  -6.98,-64.64 0 top  (outside the outline)
R28  -10.54,-133.98 0 top  (outside the outline)
R29  -6.98,-133.98 0 top  (outside the outline)
R30  -3.43,-133.98 0 top  (outside the outline)
R31  -10.54,-137.29 0 top  (outside the outline)
R32  4.7,-172.85 0 top  (outside the outline)
R33  8.25,-172.85 0 top  (outside the outline)
R34  11.81,-172.85 0 top  (outside the outline)
R35  15.37,-172.85 0 top  (outside the outline)
R36  -3.43,-95.38 0 top  (outside the outline)
R37  -10.54,-176.91 0 top  (outside the outline)
R38  -3.43,-64.64 0 top  (outside the outline)
R39  0.13,-64.64 0 top  (outside the outline)
R40  -6.98,-176.91 0 top  (outside the outline)
R42  3.68,-64.64 0 top  (outside the outline)
R49  -6.98,-180.21 0 top  (outside the outline)
R50  -3.43,-180.21 0 top  (outside the outline)
R51  0.13,-95.38 0 top  (outside the outline)
R52  0.13,-180.21 0 top  (outside the outline)
R53  3.68,-180.21 0 top  (outside the outline)
R55  5.97,-37.72 0 top  (outside the outline)
R58  9.53,-37.72 0 top  (outside the outline)
R59  -10.54,-42.04 0 top  (outside the outline)
R60  -6.98,-42.04 0 top  (outside the outline)
R61  -3.43,-42.04 0 top  (outside the outline)
R93  0.13,-42.04 0 top  (outside the outline)
R101  11.57,86.36 180 top
R102  11.57,67.36 180 top
R103  11.57,48.37 180 top
R104  11.57,29.36 180 top
R105  8.5,46.62 180 top
R106  20.57,55.87 0 top
R107  20.57,57.37 180 top
R108  20.57,43.37 0 top
R110  20.57,41.87 180 top
R201  37.07,86.36 180 top
R202  37.07,67.36 180 top
R203  37.07,48.37 180 top
R204  37.07,29.36 180 top
R205  8.5,45.09 180 top
R206  26.07,55.87 180 top
R207  26.07,57.37 0 top
R208  26.07,43.37 180 top
R210  26.07,41.87 0 top
R505  46.4,36.4 0 top
R506  46.4,34.41 0 top
R507  46.4,30.36 0 top
R508  46.4,28.38 0 top
SJ1  10.54,85.72 0 bottom
SJ2  10.54,66.67 0 bottom
SJ3  10.54,47.62 0 bottom
SJ4  10.54,28.57 0 bottom
SJ5  35.94,85.72 0 bottom
SJ6  35.94,66.67 0 bottom
SJ7  35.94,47.62 0 bottom
SJ8  35.94,28.57 0 bottom
SV1  45.03,66.85 90 bottom

### Tracks (layer width: path | path; a pad name or v marks a point on that pad's centre or on a via)
+12V  (via drill 0.4)  (1 unrouted)
  Top 0.305: 20.07,71.85 C201.1
  Top 0.406: v18.57,49.62 IC1.4 | C101.1 v18.57,60.87 | C201.1 v18.57,71.86 | IC2.4 v18.58,66.67 v18.57,66.66 | C1.+ 45.07,76.91 Q1.2 43.37,75.96 41.47,74.06 v18.57,74.06 | v18.57,27.42 v18.57,27.41 19.67,27.41 C27.1 | 18.61,28.96 v18.57,28.92
  Bottom 0.406: v18.57,74.06 v18.57,71.86 v18.57,66.66 v18.57,60.87 v18.57,49.62 v18.57,28.92 v18.57,27.42
-10V1  (2 unrouted)
-10V2  (2 unrouted)
-12V  (via drill 0.4)
  Top 0.406: IC2.11 v28.07,66.67 | C202.1 v28.07,71.86 | C102.1 v28.06,60.87 v28.07,60.88 | IC1.11 v28.07,49.62 | v28.07,49.62 | Q2.2 46.97,56.82 46.97,51.37 46.27,50.66 C2.- 43.37,50.66 38.16,45.46 31.37,45.46 30.32,46.51 30.32,48.52 29.22,49.62 v28.07,49.62 | v28.07,27.38 C28.1 | v28.07,32.77
  Bottom 0.406: v28.07,71.86 v28.07,66.67 v28.07,60.88 v28.07,49.62 v28.07,32.77 v28.07,27.38
CLAMP_REF  (1 unrouted)
CV_SUM+_A  (2 unrouted)
GND  (via drill 0.4)  (90 unrouted)
  Top 0.406: C101.2 v22.23,60.87 v24.42,60.87 C102.2 | IC1.3 v17.84,50.89 | POT4B.P$6 46.1,38.73 47.25,37.59 R505.2 R506.2 R507.2 R508.2 | v28.79,48.34 IC1.10 | 20.45,48.34 IC1.5 17.85,48.35 v17.84,48.34 16.97,48.34 v15.94,47.31 | C1.- 46.42,83.06 47.12,82.36 47.12,77.06 Q1.1 46.02,74.69 47.5,73.21 47.5,70.59 SV1.8 | C2.+ 45.07,56.82 Q2.1 40.46,57.77 POT3B.P$6 | C27.2 21.97,27.36 v21.99,27.39 v24.69,27.39 24.77,27.31 25.22,27.31 C28.2 | 5O.P3 40.82,32.37 39.22,33.97 30.16,33.97 v30.1,33.91 | v28.97,55.27 31.47,57.77 | 40.42,57.77 v36.12,57.77 31.52,57.77 | v29.11,53.11 32.92,53.11 v33.24,52.8 | v28.79,50.89 IC1.12 | v21.99,18.5 v24.69,18.5 | v13.74,22.31 v21.99,22.31 v24.69,22.31 26.97,22.31 27.69,21.59 31.5,21.59 32.22,22.31 v32.31,22.31
  Top 0.61: C202.2 v24.32,71.86 | C201.2 v22.33,71.86
  other vias: 36.57,33.97 38.67,33.97 21.74,48.34 24.84,48.34 15.33,22.31
  pour Bottom: -12.32,-0.64 54.99,-0.64 54.99,99.69 -12.32,99.69
IC2_1  (3 unrouted)
IC2_8  (3 unrouted)
IC2_13  (3 unrouted)
IC2C_1  (2 unrouted)
IC2C_11  (2 unrouted)
IN_1  (via drill 0.4)
  Top 0.305: IC2.12 27.2,67.94 28.17,68.91 v29.47,68.91
  Top 0.406: R505.1 43.6,36.4 5O.P1 39.12,36.37 36.77,38.72 36.77,43.91 36.12,44.57 v35.22,44.57 | IN_1.P$3 5.53,23.26 27.37,23.26 28.07,22.56 30.97,22.56 34.52,26.11 39.87,26.11 v40.67,26.91
  Bottom 0.406: v40.67,26.91 39.87,27.71 39.87,34.62 41.62,36.37 5O.P1 | v29.47,68.91 35.37,63.02 35.37,56.07 32.02,52.72 32.02,45.87 33.27,44.57 v35.22,44.57
IN_2  (via drill 0.4)
  Top 0.305: IC2.10 28.71,65.41 v29.47,66.16
  Top 0.406: R506.1 43.61,34.41 5O.P2 41.72,34.37 40.42,35.66 38.72,35.66 35.22,39.16 v35.22,42.32 | IN_2.P$3 27.08,24.6 28.37,23.31 30.62,23.31 34.22,26.91 39.47,26.91 v40.67,28.11
  Bottom 0.406: v40.67,28.11 40.67,33.66 41.37,34.37 5O.P2 | v29.47,66.16 33.92,61.72 33.92,56.66 30.67,53.41 30.67,44.87 33.22,42.32 v35.22,42.32
IN_3  (via drill 0.4)
  Top 0.305: IC2.5 22.02,65.41 22.67,64.77 28.92,64.77 v29.47,64.21
  Top 0.406: R507.1 5O.P4 41.47,30.36 38.97,27.86 32.87,27.86 v32.24,27.23 29.61,24.6 IN_3.P$3
  Bottom 0.406: v29.47,64.21 29.47,59.57 29.12,59.22 29.12,56.37 30.02,55.47 30.02,44.47 33.97,40.52 33.97,36.87 31.22,34.12 31.22,28.24 v32.24,27.23
IN_4  (via drill 0.4)
  Top 0.305: IC2.3 22.64,67.94 23.27,67.31 27.52,67.31 27.82,67.61 v29.47,67.61
  Top 0.406: 5O.P5 R508.1 | v41.57,33.22 39.97,34.82 38.47,34.82 37.22,36.07 35.07,38.32 34.37,39.02 34.37,43.07 34.72,43.41 35.17,43.41 v35.22,43.37
  Bottom 0.406: IN_4.P$3 43.57,25.88 5O.P5 42.92,28.36 41.57,29.71 v41.57,33.22 | v29.47,67.61 34.67,62.41 34.67,56.41 31.37,53.12 31.37,45.32 33.27,43.41 35.02,43.41 35.07,43.37 v35.22,43.37
IN_A
  Top 0.406: R105.2 3.33,46.62 3I.P3
IN_A1  (via drill 0.4)  (1 unrouted)
  Top 0.406: v17.43,69.21 IC2.2
  Top 0.61: IC2.2 IC2.1
  Bottom 0.406: v17.43,69.21 17.43,52 16.72,51.2 16.72,43.22 13.07,39.57 13.07,31.26
IN_A2  (via drill 0.4)  (2 unrouted)
  Top 0.406: IC2.7 IC2.6 | v11.18,62.87 IC2.7 | IC2.7 22.97,62.87 23.87,61.97 v36.89,61.97
  Bottom 0.406: 13.04,50.84 11.18,52.71 v11.18,62.87 | 38.44,50.84 36.89,52.39 v36.89,61.97
IN_B
  Top 0.406: 3I.P1 4.93,42.37 R205.2
IN_B1  (via drill 0.4)
  Top 0.406: IC2.9 IC2.8 v38.45,62.87
  Bottom 0.406: 38.44,63.46 v38.45,62.87
IN_B2  (1 unrouted)
IN_SW_1
  Top 0.406: 5I.P5 1.71,36.37 0.51,35.16 0.51,18.46 2.66,16.31 IN_1.P$2
IN_SW_2  (via drill 0.4)
  Top 0.406: IN_2.P$2 10.48,16.3 10.47,16.31 v6.97,16.31
  Bottom 0.406: 5I.P4 1.32,34.37 0.57,33.62 0.57,18.86 1.82,17.61 5.67,17.61 v6.97,16.31
IN_SW_3
  Top 0.406: 5I.P2 2.32,30.36 1.32,29.36 1.32,23.11 2.67,21.76 5.41,21.76 9.51,17.66 28.23,17.66 IN_3.P$2
IN_SW_4  (via drill 0.4)
  Top 0.406: IN_4.P$2 34.51,16.3 v30.61,12.32
  Bottom 0.406: 5I.P1 2.42,27.71 2.42,23.98 3.83,22.56 6.89,22.56 9.02,20.44 9.02,13.34 11.81,10.79 29.08,10.79 v30.61,12.32
LIN+_OUT_A  (7 unrouted)
LIN_POS_A  (1 unrouted)
N$1
  Top 0.406: SV1.1 45.07,61.77 | 45.07,61.77 SV1.2 | Q2.3 45.07,61.77
N$2  (2 unrouted)
N$3  (2 unrouted)
N$4  (1 unrouted)
N$5
  Top 0.406: R210.1 R208.2 25.22,45.72 25.32,45.82 IC1.8
N$6
  Top 0.406: R110.1 21.57,41.87 21.57,43.22 R108.2 21.42,45.72 21.32,45.82 IC1.7 20.7,45.87
N$7  (via drill 0.4)
  Top 0.406: R206.1 28.07,55.87 | 28.07,55.87 28.07,52.16 IC1.13 30.23,52.16 31.37,51.02 31.37,47.57 32.43,46.51 v37.52,46.51 37.92,47.41 R203.1 | 38.41,29.36 R204.1 39.12,29.36 39.87,30.11 39.87,31.96 38.77,33.07 v37.92,33.07 | 37.82,86.36 R201.1 v38.42,86.36 | R202.1 v40.17,67.36 40.17,62.47 38.62,60.91 29.92,60.91 28.07,59.07 | 28.07,55.87 28.07,59.07 | 28.07,59.07 18.47,59.07 17.52,58.12 17.52,55.02 v15.57,53.07 | R205.1 12.29,45.09 15.57,48.37 v15.57,51.32
  Bottom 0.406: v37.52,46.51 37.52,33.47 v37.92,33.07 | v40.17,67.36 40.17,72.16 37.92,74.41 37.92,85.81 38.42,86.31 v38.42,86.36 | v15.57,51.32 v15.57,53.07
N$8  (2 unrouted)
N$9  (via drill 0.4)
  Top 0.406: R110.2 v17.77,41.87 | v10.29,14.1 5.62,9.43 OUT_A+.P$3
  Bottom 0.406: v17.77,41.87 17.77,27.91 10.29,20.43 v10.29,14.1 10.29,13.84
N$10
  Top 0.406: R207.1 R206.2 25.22,53.52 | 25.22,53.52 25.37,53.37 25.44,53.43 IC1.14 | 24.07,38.37 24.07,38.41 24.07,53.12 24.37,53.41 25.02,53.41 | 25.02,53.41 25.07,53.37 | 25.02,53.41 25.12,53.41 25.22,53.52
N$11  (via drill 0.4)
  Top 0.406: IC1.2 18.57,52.16 | 18.57,52.16 14.77,52.16 | R106.1 18.92,55.87 18.57,55.52 18.57,52.16 | v12.45,65.41 12.45,67.34 R102.1 | 14.77,52.16 14.72,52.11 14.72,49.32 13.77,48.37 R103.1 12.42,47.32 v11.73,46.62 R105.1 | 14.77,52.16 14.73,52.16 v14.72,52.17 | v11.72,33.02 13.77,33.02 14.92,31.86 14.92,30.26 14.02,29.36 R104.1
  Top 0.61: R101.1 v12.57,85.77
  Bottom 0.305: v11.73,46.62 v11.73,33.02
  Bottom 0.406: v14.72,52.17 12.45,54.44 v12.45,65.41 14.99,67.94 14.99,70.48 12.45,73.02 12.45,85.64 v12.57,85.77 | v11.73,33.02 v11.72,33.02
N$12  (2 unrouted)
N$13
  Top 0.406: R107.1 R106.2 21.42,53.72 21.17,53.47 | 21.17,53.47 21.07,53.37 20.71,53.37 IC1.1 | 22.47,38.47 22.47,53.12 22.17,53.41 21.22,53.41 21.17,53.47
N$14
  Top 0.406: SV1.9 45.07,71.93 | 45.07,71.93 SV1.10 | Q1.3 45.07,71.93
N$15  (via drill 0.4)
  Top 0.406: R210.2 v28.87,41.87
  Bottom 0.406: OUT_B+.P$3 31.97,6.04 31.97,21.04 30.1,22.91 28.77,22.91 27.87,23.81 27.87,25.16 28.87,26.16 v28.87,41.87
N$16  (2 unrouted)
N$17  (via drill 0.4)
  Top 0.406: v7.75,85.72 7.75,86.34 R1.2
  Bottom 0.406: SJ1.2 v7.75,85.72
N$18  (via drill 0.4)
  Top 0.406: R107.2 19.72,57.77 v19.52,58.22 | IC1.6 19.54,47.08 v19.52,47.07 | R108.1 19.72,43.66 v19.52,44.17
  Bottom 0.406: v19.52,44.17 v19.52,47.07 v19.52,58.22
N$19  (1 unrouted)
N$20
  Top 0.406: R11.1 R201.2 35.94,86.36 POT1B.2
N$21  (2 unrouted)
N$22  (via drill 0.4)
  Top 0.406: v7.75,66.67 7.75,67.34 R2.2
  Bottom 0.406: SJ2.2 v7.75,66.67
N$23  (via drill 0.4)
  Top 0.406: R207.2 26.92,57.72 v27.07,58.12 | v27.01,47.08 26.79,47.08 26.77,47.07 25.86,47.07 IC1.9 | v27.02,44.17 27.02,43.47 R208.1
  Bottom 0.406: v27.07,58.12 27.01,57.8 v27.01,47.08 27.01,43.93 v27.02,44.17
N$24  (via drill 0.4)
  Top 0.406: v6.98,48.39 7.7,48.39 R4.2
  Bottom 0.406: SJ3.2 7.75,47.62 v6.98,48.39
N$25  (via drill 0.4)
  Top 0.406: v7.75,28.57 7.75,29.34 R7.2
  Bottom 0.406: SJ4.2 v7.75,28.57
N$26  (via drill 0.4)
  Top 0.406: v33.4,85.72 33.4,86.18 R11.2
  Bottom 0.406: SJ5.2 v33.4,85.72
N$27  (2 unrouted)
N$28  (via drill 0.4)
  Top 0.406: v33.4,66.67 33.4,67.18 R8.2
  Bottom 0.406: SJ6.2 v33.4,66.67
N$29
  Top 0.406: R1.1 R101.2 10.54,86.36 POT1A.2
N$30
  Top 0.406: R8.1 R202.2 35.94,67.36 POT2B.2
N$31
  Top 0.406: R9.1 R203.2 35.94,48.65 POT3B.2
N$32  (via drill 0.4)
  Top 0.406: v33.15,47.62 33.15,48.29 R9.2
  Bottom 0.406: SJ7.2 v33.15,47.62
N$33  (via drill 0.4)
  Top 0.406: v33.4,28.57 33.4,29.18 R10.2
  Bottom 0.406: SJ8.2 v33.4,28.57
N$34  (via drill 0.4)
  Top 0.305: POT1A.3 13.04,88.3
  Top 0.406: POT1A.3 14.8,90.14 v28.96,90.14 36.69,90.14 POT1B.3
  Bottom 0.406: v28.96,70.48 v28.96,90.14
N$35  (2 unrouted)
N$36  (1 unrouted)
N$37  (1 unrouted)
N$38  (1 unrouted)
N$39  (2 unrouted)
N$40  (2 unrouted)
N$41  (1 unrouted)
N$42  (2 unrouted)
N$43  (3 unrouted)
N$44
  Top 0.406: R10.1 R204.2 35.94,29.64 POT4B.2
N$45  (2 unrouted)
N$46  (2 unrouted)
N$47
  Top 0.406: R7.1 R104.2 10.54,29.54 POT4A.2
N$48  (2 unrouted)
N$49
  Top 0.406: R4.1 R103.2 10.54,48.55 POT3A.2
N$50  (2 unrouted)
N$51
  Top 0.406: R2.1 R102.2 10.54,67.55 POT2A.2
N$53  (2 unrouted)
N$54  (1 unrouted)
N$55  (2 unrouted)
N$56  (1 unrouted)
N$57  (2 unrouted)
N$58  (2 unrouted)
N$62  (1 unrouted)
N$63  (2 unrouted)
N$64  (3 unrouted)
OFFSET_LIN  (3 unrouted)
OFFSET_REF  (2 unrouted)
OUT_A1  (1 unrouted)
OUT_A2  (1 unrouted)
OUT_SW_A  (via drill 0.4)
  Top 0.406: v46.97,9.44 41.98,4.45 16.46,4.45 OUT_A+.P$2
  Bottom 0.406: 3O.P1 45.57,46.37 46.97,44.97 v46.97,9.44
OUT_SW_B
  Bottom 0.406: 3O.P3 44.32,42.37 45.77,40.97 45.77,13.86 45.41,13.54 42.23,10.37 OUT_B+.P$2
V+  (11 unrouted)
V-  (11 unrouted)
V_REF  (5 unrouted)
VCA_IN  (3 unrouted)
VCA_OUT  (7 unrouted)

### Text on the board
tPlace: LinearMixer Rev04 | Rebel Technology
bPlace: Rebel Technology | LinearMixer Rev04 | -12v